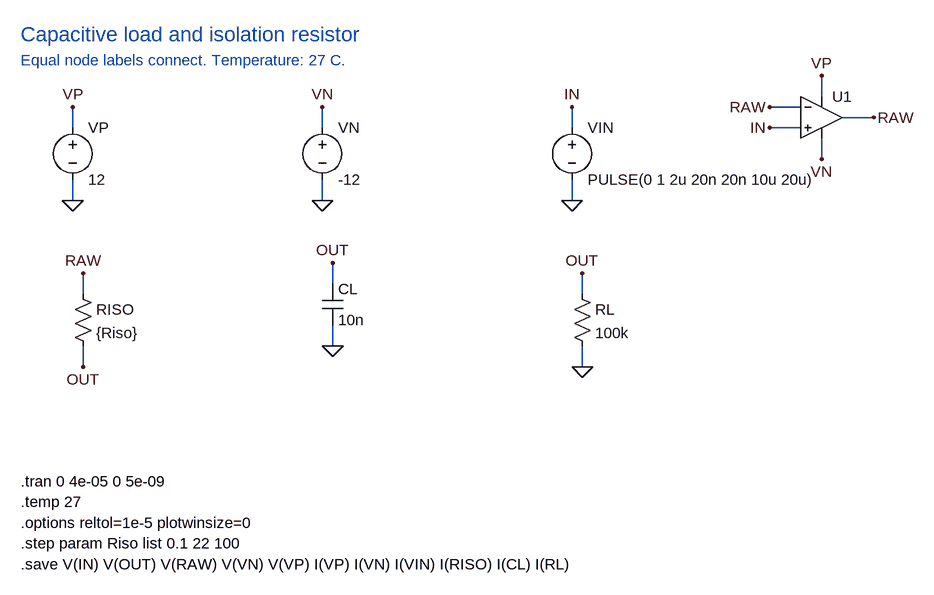
[diagram p0: schematic capacitive-load-compensation.asc]
capacitive-load-compensation.asc, the LTspice schematic file:
Version 4
SHEET 1 1740 1000
WIRE 144 176 144 144
WIRE 144 256 144 288
WIRE 528 176 528 144
WIRE 528 256 528 288
WIRE 912 176 912 144
WIRE 912 256 912 288
WIRE 1264 176 1216 176
WIRE 1264 144 1216 144
WIRE 1296 128 1296 96
WIRE 1296 192 1296 224
WIRE 1328 160 1376 160
WIRE 160 432 160 400
WIRE 160 512 160 544
WIRE 544 416 544 384
WIRE 544 480 544 512
WIRE 928 432 928 400
WIRE 928 512 928 544
FLAG 144 144 VP
FLAG 144 288 0
FLAG 528 144 VN
FLAG 528 288 0
FLAG 912 144 IN
FLAG 912 288 0
FLAG 1216 176 IN
FLAG 1216 144 RAW
FLAG 1296 96 VP
FLAG 1296 224 VN
FLAG 1376 160 RAW
FLAG 160 400 RAW
FLAG 160 544 OUT
FLAG 544 384 OUT
FLAG 544 512 0
FLAG 928 400 OUT
FLAG 928 544 0
SYMBOL voltage 144 160 R0
SYMATTR InstName VP
SYMATTR Value 12
SYMBOL voltage 528 160 R0
SYMATTR InstName VN
SYMATTR Value -12
SYMBOL voltage 912 160 R0
SYMATTR InstName VIN
SYMATTR Value PULSE(0 1 2u 20n 20n 10u 20u)
SYMBOL OpAmps/UniversalOpamp2 1296 160 R0
SYMATTR InstName U1
SYMATTR SpiceModel level2
SYMATTR Value2 Avol=1Meg GBW=10Meg Slew=10Meg
SYMATTR SpiceLine Ilimit=100m Rail=0.5 Vos=0
SYMATTR SpiceLine2 En=0 Enk=0 In=0 Ink=0 Rin=1G
SYMBOL res 144 416 R0
SYMATTR InstName RISO
SYMATTR Value {Riso}
SYMBOL cap 528 416 R0
SYMATTR InstName CL
SYMATTR Value 10n
SYMBOL res 912 416 R0
SYMATTR InstName RL
SYMATTR Value 100k
TEXT 64 32 Left 3 ;Capacitive load and isolation resistor
TEXT 64 72 Left 2 ;Equal node labels connect. Temperature: 27 C.
TEXT 64 720 Left 2 !.tran 0 4e-05 0 5e-09
TEXT 64 752 Left 2 !.temp 27
TEXT 64 784 Left 2 !.options reltol=1e-5 plotwinsize=0
TEXT 64 816 Left 2 !.step param Riso list 0.1 22 100
TEXT 64 848 Left 2 !.save V(IN) V(OUT) V(RAW) V(VN) V(VP) I(VP) I(VN) I(VIN) I(RISO) I(CL) I(RL)

The netlist it stands for:
* capacitive-load-compensation.asc
VP VP 0 12
VN VN 0 -12
VIN IN 0 PULSE(0 1 2u 20n 20n 10u 20u)
XU1 IN RAW VP VN RAW level2 Avol=1Meg GBW=10Meg Slew=10Meg Ilimit=100m Rail=0.5 Vos=0 En=0 Enk=0 In=0 Ink=0 Rin=1G  ; pins In+ In- V+ V- OUT
RISO RAW OUT {Riso}
CL OUT 0 10n
RL OUT 0 100k
* Capacitive load and isolation resistor
* Equal node labels connect. Temperature: 27 C.
.tran 0 4e-05 0 5e-09
.temp 27
.options reltol=1e-5 plotwinsize=0
.step param Riso list 0.1 22 100
.save V(IN) V(OUT) V(RAW) V(VN) V(VP) I(VP) I(VN) I(VIN) I(RISO) I(CL) I(RL)
.lib UniversalOpAmp2.lib
.backanno
.end